# EAGLE design TIMER_ARDUINO(NPN) (EAGLE 6.1)
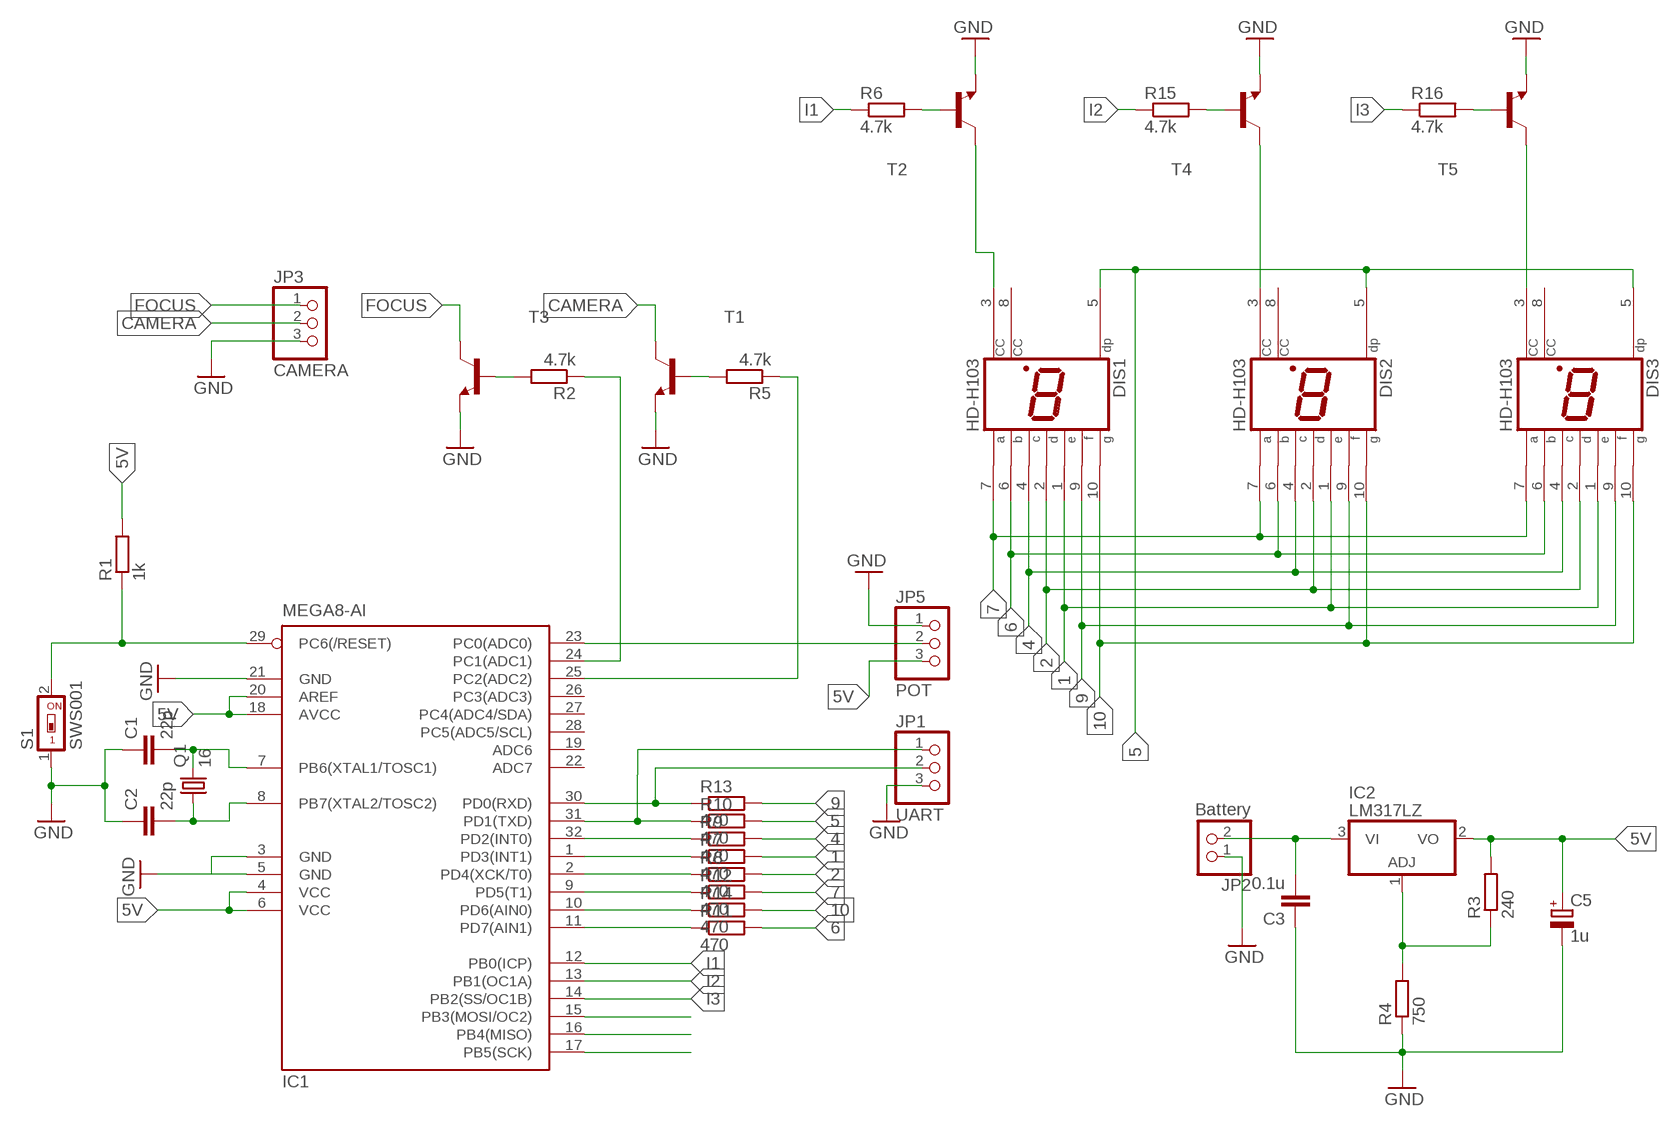
[diagram p0: schematic, sheet 1]

## Parts
C1  22p  C-EUC0805  [C0805]
C2  22p  C-EUC0805  [C0805]
C3  0.1u  C-EUC0805  [C0805]
C5  1u  CPOL-EU153CLV-0405  [153CLV-0405]
DIS1  HD-H103  [HDSP-M]
DIS2  HD-H103  [HDSP-M]
DIS3  HD-H103  [HDSP-M]
IC1  MEGA8-AI  [TQFP32-08]
IC2  LM317LZ  [TO92]
JP1  UART  PINHD-1X3  [1X03]
JP2  Battery  PINHD-1X2  [1X02]
JP3  CAMERA  PINHD-1X3  [1X03]
JP5  POT  PINHD-1X3  [1X03]
Q1  16  CRYSTALHC33U-V  [HC33U-V]
R1  1k  R-EU_R1206  [R1206]
R2  4.7k  R-EU_R0805  [R0805]
R3  240  R-EU_R0805  [R0805]
R4  750  R-EU_R0805  [R0805]
R5  4.7k  R-EU_R0805  [R0805]
R6  4.7k  R-EU_R0805  [R0805]
R7  470  R-EU_R0805  [R0805]
R8  470  R-EU_R0805  [R0805]
R9  470  R-EU_R0805  [R0805]
R10  470  R-EU_R0805  [R0805]
R11  470  R-EU_R0805  [R0805]
R12  470  R-EU_R0805  [R0805]
R13  470  R-EU_R0805  [R0805]
R14  470  R-EU_R0805  [R0805]
R15  4.7k  R-EU_R0805  [R0805]
R16  4.7k  R-EU_R0805  [R0805]
S1  SWS001  [SMS-001]
T1  BC846B-NPN-SOT23-BEC  [SOT23-BEC]
T2  BC846B-NPN-SOT23-BEC  [SOT23-BEC]
T3  BC846B-NPN-SOT23-BEC  [SOT23-BEC]
T4  BC846B-NPN-SOT23-BEC  [SOT23-BEC]
T5  BC846B-NPN-SOT23-BEC  [SOT23-BEC]

## Nets
1: DIS1.1(E) DIS2.1(E) DIS3.1(E) R7.2
2: DIS1.2(D) DIS2.2(D) DIS3.2(D) R8.2
4: DIS1.4(C) DIS2.4(C) DIS3.4(C) R9.2
5: DIS1.5(DP) DIS2.5(DP) DIS3.5(DP) R10.2
5V: C5.+ IC1.4(VCC) IC1.6(VCC) IC1.18(AVCC) IC1.20(AREF) IC2.2(VO) JP5.3 R1.2 R3.2
6: DIS1.6(B) DIS2.6(B) DIS3.6(B) R11.2
7: DIS1.7(A) DIS2.7(A) DIS3.7(A) R12.2
9: DIS1.9(F) DIS2.9(F) DIS3.9(F) R13.2
10: DIS1.10(G) DIS2.10(G) DIS3.10(G) R14.2
CAMERA: JP3.2 T1.C
FOCUS: JP3.1 T3.C
GND: C1.1 C2.1 C3.1 C5.- IC1.5(GND) IC1.21(GND) JP1.3 JP2.1 JP3.3 JP5.1 R4.1 S1.1 T1.E T2.E T3.E T4.E T5.E
I1: IC1.12(PB0(ICP)) R6.1
I2: IC1.13(PB1(OC1A)) R15.1
I3: IC1.14(PB2(SS/OC1B)) R16.1
N$1: IC1.29(PC6(/RESET)) R1.1 S1.2
N$2: IC1.23(PC0(ADC0)) JP5.2
N$3: IC1.3(GND)
N$4: IC1.30(PD0(RXD)) JP1.2 R13.1
N$5: IC1.31(PD1(TXD)) JP1.1 R10.1
N$6: C1.2 IC1.7(PB6(XTAL1/TOSC1)) Q1.2
N$7: IC1.32(PD2(INT0)) R9.1
N$8: C2.2 IC1.8(PB7(XTAL2/TOSC2)) Q1.1
N$9: IC1.1(PD3(INT1)) R7.1
N$10: IC1.2(PD4(XCK/T0)) R8.1
N$11: IC1.9(PD5(T1)) R12.1
N$12: IC1.10(PD6(AIN0)) R14.1
N$13: IC1.11(PD7(AIN1)) R11.1
N$14: R2.2 T3.B
N$15: C3.2 IC2.3(VI) JP2.2
N$16: IC2.1(ADJ) R3.1 R4.2
N$17: IC1.24(PC1(ADC1)) R2.1
N$18: IC1.15(PB3(MOSI/OC2))
N$19: IC1.16(PB4(MISO))
N$20: IC1.17(PB5(SCK))
N$21: R5.2 T1.B
N$22: IC1.25(PC2(ADC2)) R5.1
N$23: R6.2 T2.B
N$25: R15.2 T4.B
N$27: R16.2 T5.B
N$29: DIS1.3(CC) T2.C
N$30: DIS2.3(CC) T4.C
N$31: DIS3.3(CC) T5.C
Unconnected: DIS1.8(CC) DIS2.8(CC) DIS3.8(CC) IC1.19(ADC6) IC1.22(ADC7) IC1.26(PC3(ADC3)) IC1.27(PC4(ADC4/SDA)) IC1.28(PC5(ADC5/SCL))

## Library data of the parts
C1-C3 = resistor:C-EU: CAPACITOR, European symbol
C5 = resistor:CPOL-EU: POLARIZED CAPACITOR, European symbol
DIS1-DIS3 = display-hp:HD-H103: LED DISPLAY 1-character 7 segment, decimal point right; OC_FARNELL: unknown; OC_NEWARK: unknown
IC1 = atmel:MEGA8: MICROCONTROLLER 8 Kbytes FLASH, 1 kbytes SRAM, 512 bytes EEPROM, USART, 6-channel 10 bit ADC, 2-channel 8 bit ADC Pin compatible with Atmega48, ATMega88, ATMega168 Source: avr.lbr; MPN: ATMEGA8-16AU; OC_FARNELL: 9171371; OC_NEWARK: 73M8863
IC2 = linear:*317: Positive VOLTAGE REGULATOR
JP1 JP3 JP5 = pinhead:PINHD-1X3: PIN HEADER
JP2 = pinhead:PINHD-1X2: PIN HEADER
Q1 = crystal:CRYSTAL: CRYSTAL; OC_FARNELL: unknown; OC_NEWARK: unknown
R1-R16 = resistor:R-EU_: RESISTOR, European symbol
S1 = smd-special:SWS001: SMD Dip Switch 1 pol.
T1-T5 = transistor:*-NPN-: NPN Transistror BF959 corrected 2008.03.06

## Board
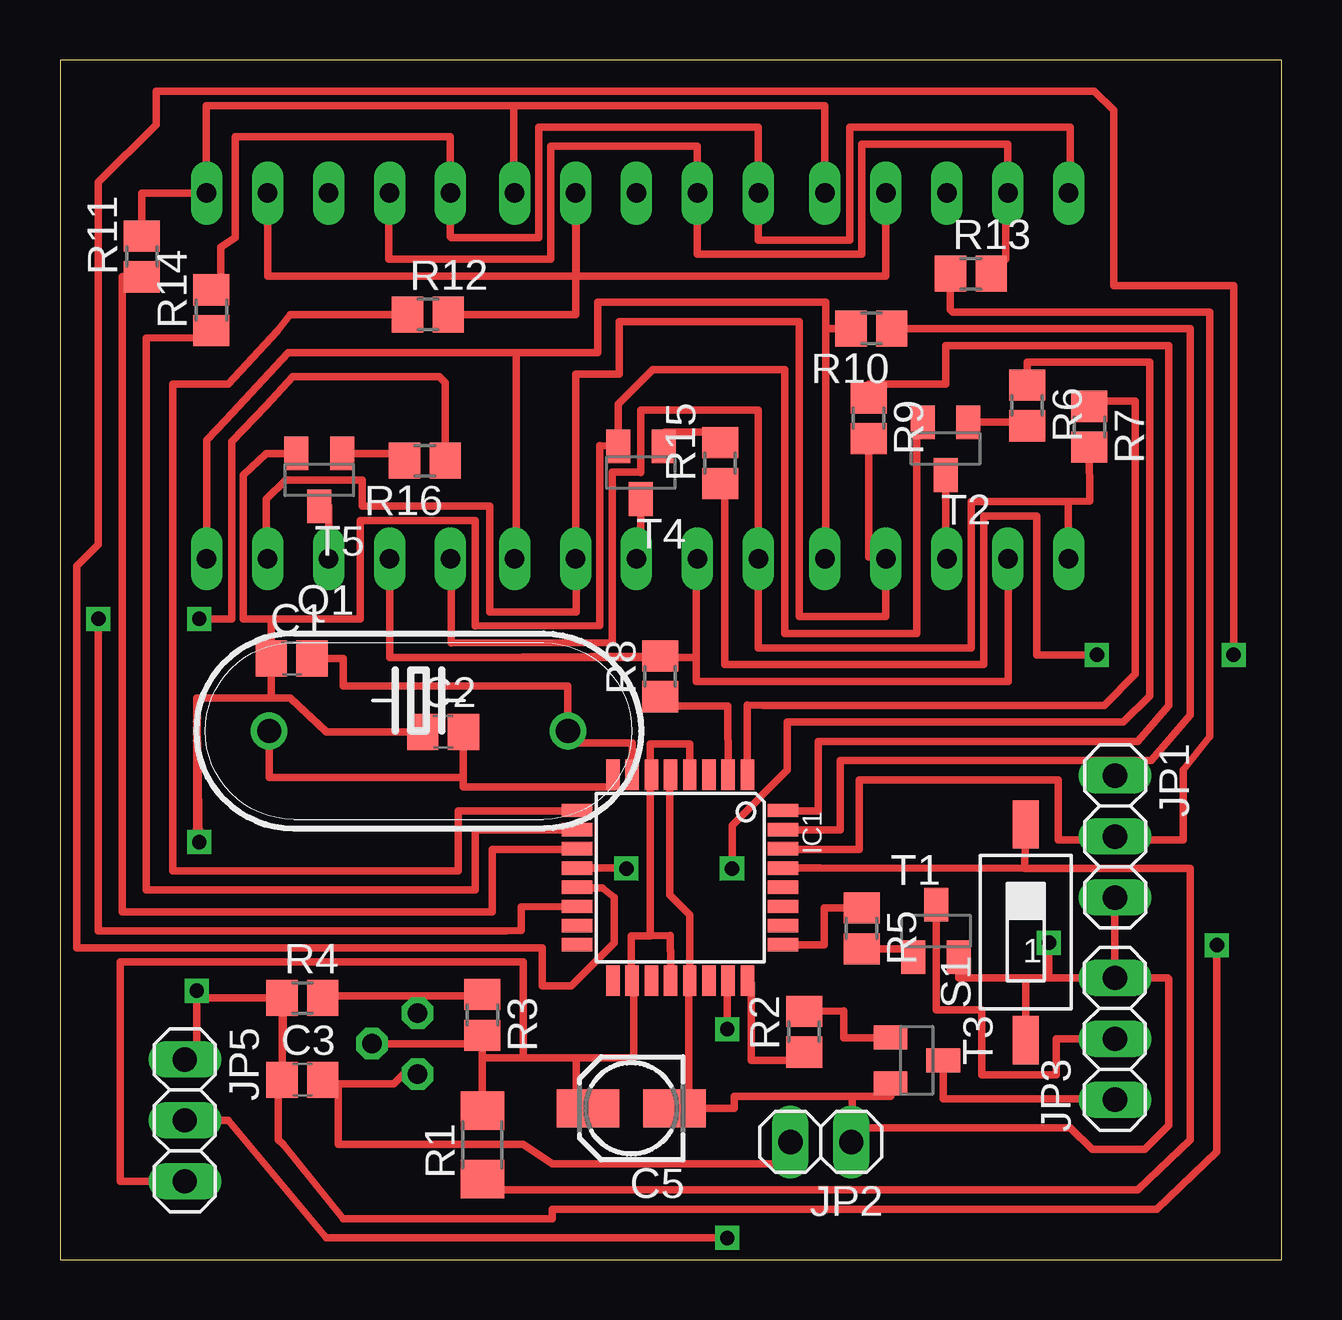
[diagram p1: board, top side]
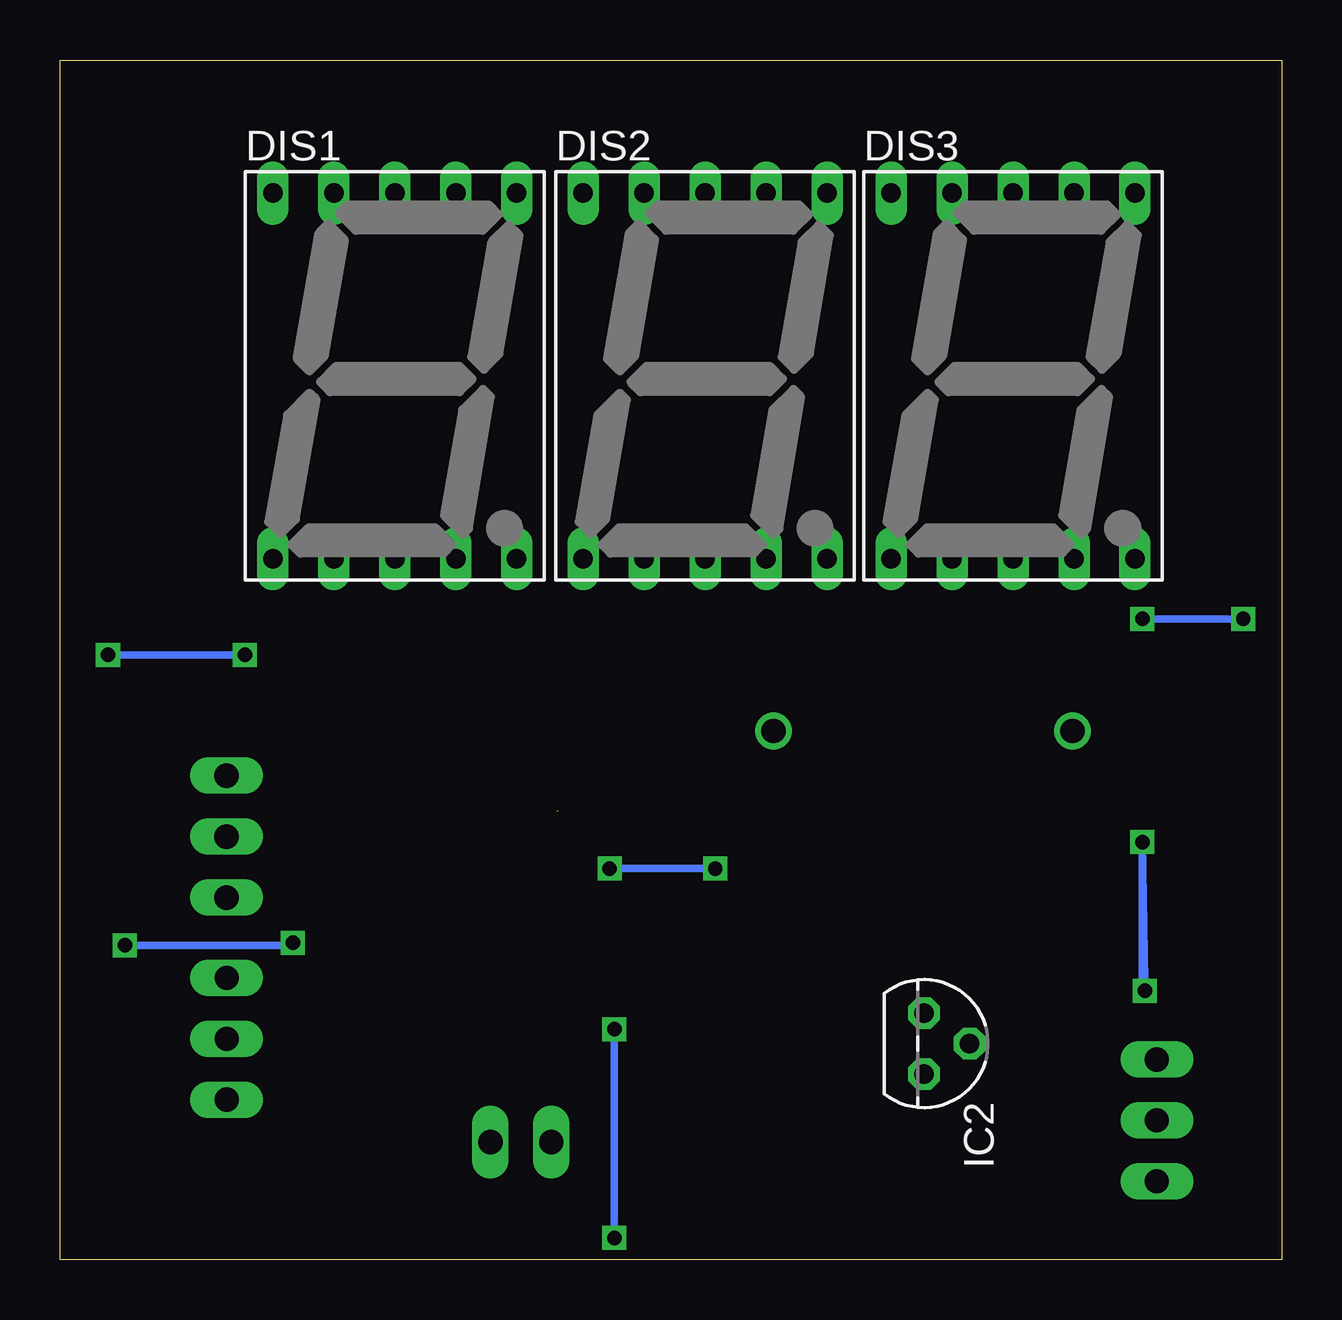
[diagram p2: board, bottom side, seen from below]

Size 50.9 x 50 mm. Coordinates in mm from the lower left corner, seen from the top.
Outline: 0,0 50.9,0 50.9,50 0,50 0,0
Copper layers (1*16): Top 0.035mm / dielectric 1.5mm / Bottom 0.035mm
Design rules: minimum track width 10mil, minimum drill 24mil, track to track 8mil, track to pad 8mil, pad to pad 8mil, via to via 8mil, smd to smd 8mil, copper to edge 40mil, drill to drill 8mil, minimum pad ring 10mil, minimum via ring 8mil, stop-mask expansion 4mil, vias tented up to drill 0mil, thermal gap 10mil

### Footprints (pad centres in the part's own frame; a part is rotated, then mirrored left to right if it is on the bottom)
C0805 = smd 1.3 x 1.5: 1 -0.85,0; 2 0.85,0
153CLV-0405 = smd 2.6 x 1.6: + 1.8,0; - -1.8,0
HDSP-M = drill 0.813 long: 1 -5.08,-7.62; 2 -2.54,-7.62; 3 0,-7.62; 4 2.54,-7.62; 5 5.08,-7.62; 6 5.08,7.62; 7 2.54,7.62; 8 0,7.62; 9 -2.54,7.62; 10 -5.08,7.62
TQFP32-08 = smd 1.27 x 0.559: 1 -4.293,2.8; 2 -4.293,2; 3 -4.293,1.2; 4 -4.293,0.4; 5 -4.293,-0.4; 6 -4.293,-1.2; 7 -4.293,-2; 8 -4.293,-2.8; 17 4.293,-2.8; 18 4.293,-2; 19 4.293,-1.2; 20 4.293,-0.4; 21 4.293,0.4; 22 4.293,1.2; 23 4.293,2; 24 4.293,2.8 | smd 0.559 x 1.27: 9 -2.8,-4.293; 10 -2,-4.293; 11 -1.2,-4.293; 12 -0.4,-4.293; 13 0.4,-4.293; 14 1.2,-4.293; 15 2,-4.293; 16 2.8,-4.293; 25 2.8,4.293; 26 2,4.293; 27 1.2,4.293; 28 0.4,4.293; 29 -0.4,4.293; 30 -1.2,4.293; 31 -2,4.293; 32 -2.8,4.293
TO92 = drill 0.813 octagon: 1 -1.27,0; 2 0,1.905; 3 1.27,0
1X03 = drill 1.016 long: 1 -2.54,0; 2 0,0; 3 2.54,0
1X02 = drill 1.016 long: 1 -1.27,0; 2 1.27,0
HC33U-V = drill 1.016: 1 -6.223,0; 2 6.223,0
R1206 = smd 1.6 x 1.803: 1 -1.422,0; 2 1.422,0
R0805 = smd 1.3 x 1.5: 1 -0.85,0; 2 0.85,0
SMS-001 = smd 1.092 x 2.007: 1 0,-4.496; 2 0,4.496
SOT23-BEC = smd 1 x 1.4: B -0.95,-1.1; C 0,1.1; E 0.95,-1.1

### Placement (x,y rotation side)
C1  9.65,25.05 0 top
C2  15.96,22 0 top
C3  10.1,7.5 0 top
C5  23.8,6.3 180 top
DIS1  36.95,36.83 0 bottom
DIS2  24.02,36.83 0 bottom
DIS3  11.19,36.83 0 bottom
IC1  25.84,15.92 270 top
IC2  14.9,9 270 bottom
JP1  43.96,17.63 270 top
JP2  31.7,4.9 180 top
JP3  43.95,9.2 90 top
JP5  5.2,5.8 270 top
Q1  14.94,22.03 0 top
R1  17.6,4.78 90 top
R2  31,9.5 90 top
R3  17.6,10.2 270 top
R4  10.1,10.9 0 top
R5  33.4,13.8 270 top
R6  40.3,35.6 270 top
R7  42.89,34.71 270 top
R8  25.01,24.31 90 top
R9  33.69,35.07 270 top
R10  33.81,38.81 180 top
R11  3.41,41.81 90 top
R12  15.33,39.39 0 top
R13  37.95,41.09 0 top
R14  6.31,39.57 90 top
R15  27.5,33.2 90 top
R16  15.2,33.3 180 top
S1  40.24,13.64 0 top
T1  36.5,13.7 0 top
T2  36.9,33.8 180 top
T3  35.7,8.3 270 top
T4  24.2,32.8 180 top
T5  10.8,32.5 180 top

### Tracks (layer width: path | path; a pad name or v marks a point on that pad's centre or on a via)
1
  Top 0.305: 16.3,29.21 16.3,25.7 23.02,25.72 23.02,32.82 24.2,32.82 | 42,31.6 37.96,31.6 37.96,25.5 29.1,25.5 DIS2.1 | 42,31.6 42,29.21 | 42,29 42,29.21 | 42,29.21 DIS1.1 | DIS2.1 29.1,32.8 | 42,31.6 42.9,31.61 R7.2 | DIS2.1 29.1,35.4 24.2,35.4 24.2,32.82 | 24.2,32.8 24.2,32.82
  Top 0.406: 16.3,29.21 DIS3.1
2
  Top 0.305: DIS3.2 13.73,25.1 16.34,25.1 | 16.34,25.1 26.5,25.1 | 26.5,25.1 26.5,29.21 DIS2.2 | 26.5,25.1 26.5,24.1 39.5,24.1 DIS1.2 | R8.2 16.34,25.1
  Top 0.406: 13.7,29.21 DIS3.2 | DIS1.2
4
  Top 0.305: 21.5,29.21 21.5,27 17.9,27 17.9,31.4 12.6,31.4 12.6,32.5 9.4,32.5 8.6,31.7 8.6,29.26 DIS3.4 | DIS2.4 21.48,36.9 23.3,36.9 23.3,39.1 30.8,39.1 30.8,26.8 34.4,26.8 DIS1.4 | R9.2 33.7,31.6 33.7,29.29 34.49,29.29 DIS1.4
  Top 0.406: 21.5,29.21 DIS2.4 | DIS1.4
5
  Top 0.305: DIS3.5 6.11,33.6 6.11,34.16 6.9,35 9.5,37.8 19,37.8 | 19,37.8 19,29.2 DIS2.5 | 19,37.8 22.4,37.8 22.4,39.9 31.9,39.9 31.9,36.8 | 31.9,36.8 31.9,29.21 DIS1.5 | R10.2 31.91,38.8 31.9,36.8
5V
  Top 0.305: IC1.4 26.24,21.5 24.6,21.5 24.6,20.21 IC1.6 24.6,20.17 24.6,13.5 | IC1.20 25.44,12.86 25.44,12.89 25.43,13.51 24.6,13.5 | 24.6,13.5 23.8,13.5 23.8,11.67 IC1.18 23.9,11.63 23.9,8.4 21.5,8.4 | 17.6,8.4 R1.2 | 17.6,8.4 R3.2 17.45,9 IC2.2 17.9,9 | 17.6,8.4 19.3,8.4 | 19.3,8.4 21.5,8.4 | C5.+ 21.5,6.8 21.5,8.4 | 19.3,8.4 19.3,12.4 2.5,12.4 2.5,3.26 JP5.3
6
  Top 0.305: DIS1.6 31.87,48.1 18.9,48.1 | DIS2.6 18.9,44.45 18.9,48.1 | 18.9,48.1 6.1,48.1 DIS3.6 | DIS3.6 6.11,44.5 | DIS3.6 3.4,44.45 3.4,42.6 3.41,42.6 R11.2
  Top 0.406: 19,44.45 DIS2.6
7
  Top 0.305: DIS1.7 34.4,41 21.5,41 21.5,44.45 DIS2.7 21.48,41 | 21.48,41 8.65,41 DIS3.7 | R12.2 21.48,39.39 21.48,41
  Top 0.406: DIS1.7
9
  Top 0.305: DIS3.9 13.7,44.45 13.7,41.7 20.46,41.7 20.46,46.4 26.56,46.4 DIS2.9 26.56,41.9 33.4,41.9 33.4,46.5 39.49,46.5 DIS1.9 39.4,44.45 39.4,41.69 R13.2
10
  Top 0.305: 42.1,44.45 42.1,47.2 32.9,47.2 32.9,42.5 29.1,42.5 DIS2.10 29.1,47.2 19.96,47.2 19.96,42.6 16.3,42.6 16.27,42.63 DIS3.10 16.27,46.8 7.3,46.8 7.3,42.6 6.7,42.2 6.7,41.8 6.71,40.4 R14.2
  Top 0.406: 42.1,44.45 DIS1.10
CAMERA
  Top 0.305: JP3.2 41.5,9.2 41.5,7.7 38.4,7.7 38.4,10.4 36.5,10.4 T1.C
FOCUS
  Top 0.305: JP3.1 42.7,6.66 42.7,6.7 36.8,6.7 T3.C
GND  (via drill 0.6)
  Top 0.305: C3.1 R4.1 9.2,10.9 | C3.1 9.15,6.85 | 9.15,6.85 9.1,6.8 9.1,5 9.3,4.8 11.8,1.7 20.5,1.7 20.5,2.1 45.7,2.1 48.2,4.5 v48.2,13.1 | 5.8,10.9 5.7,10.9 v5.7,11.2 5.7,8.34 JP5.1 | 9.1,6.9 C3.1 | 11.11,22 9.6,23.4 | 8.8,23.4 5.7,23.4 | 5.7,23.4 v5.8,17.4 5.7,17.5 5.7,23.4 | 8.8,23.4 C1.1 8.8,26.7 | JP3.3 43.9,11.8 | S1.1 40.24,11.73 40.2,11.74 | 40.2,11.74 41.2,11.74 | 41.2,11.74 JP3.3 | JP1.3 JP3.3 | C5.- 26.2,6.3 | 26.2,6.3 28.1,6.3 28.1,6.8 33,6.8 | JP3.3 46.16,11.74 46.2,11.7 46.2,5.6 45.2,4.6 43,4.6 42.1,5.5 33.2,5.5 32.97,5.73 | 26.2,6.3 26.2,11.59 IC1.21 26.24,14.36 25.4,15.2 25.4,20.17 IC1.5 | 32.97,5.73 JP2.1 | 32.97,5.73 33,5.76 33,6.8 | C2.1 11.11,22 | 11.11,22 11.1,22 9.6,23.4 | 9.6,23.4 8.8,23.4 | 5.7,11 5.8,10.9 | 5.8,10.9 9.2,10.9 | 9.2,10.9 9.3,11 9.3,9.3 | 9.2,6.9 9.15,6.85 | v41.2,13.2 41.2,11.74 | T3.E 34.61,6.81 33,6.8 | T1.E 37.45,11.74 40.2,11.74 | T5.E 8.6,33.6 7.65,32.7 7.65,26.7 8.8,26.7 | 8.8,26.7 12.5,26.7 12.5,30.8 17.3,30.8 17.3,26.4 22.49,26.42 22.49,33.92 T4.E 23.25,35.65 24.7,37.1 30.2,37.1 30.2,26.1 35.7,26.1 35.7,34.65 T2.E
  Bottom 0.305: v48.2,13.1 41.3,13.1 v41.2,13.2 | v5.7,11.2 5.7,11.6 v5.8,17.4 5.8,11.3 v5.7,11.2
I1  (via drill 0.6)
  Top 0.305: IC1.12 23.68,16.32 v23.6,16.3 | v28,16.3 28,18.1 30.3,20.4 30.3,22.4 44.3,22.4 45.4,23.5 45.4,37.4 40.3,37.4 R6.1
  Bottom 0.305: v23.6,16.3 v28,16.3
I2  (via drill 0.6)
  Top 0.305: R15.1 arc-90 27.7,32.15 27.7,24.8 38.48,24.8 38.48,31 40.7,31 40.7,25.2 v43.2,25.2 | v48.9,25.2 48.9,40.6 43.9,40.6 43.9,47.9 43.1,48.7 4,48.7 4,47.3 1.6,44.9 1.6,29.8 0.7,28.9 0.7,13 20.1,13 20.1,11.4 21.3,11.4 23.1,13.2 23.1,15.1 22.6,15.5 21.57,15.5 IC1.13
  Bottom 0.305: v43.2,25.2 v48.9,25.2
I3  (via drill 0.6)
  Top 0.305: v1.6,26.7 1.6,13.7 18.6,13.7 19.21,13.71 19.23,14.7 IC1.14 | R16.1 16.05,36.55 15.8,36.8 9.7,36.8 8.6,35.6 7.15,34.09 7.15,26.69 v5.8,26.7
  Bottom 0.305: v5.8,26.7 v1.6,26.7
N$1
  Top 0.305: IC1.29 31.68,16.32 40.2,16.3 | 40.2,16.3 47.1,16.3 47.1,5 44.9,2.9 17.6,2.9 R1.1 | S1.2 40.2,16.3
N$2  (via drill 0.6)
  Top 0.305: v27.8,0.9 11.1,0.9 7,5.8 JP5.2 | v27.8,9.6 27.8,11.59 IC1.23
  Bottom 0.305: v27.8,0.9 v27.8,9.6
N$4
  Top 0.305: R13.1 37.1,39.6 37.2,39.5 47.9,39.5 47.9,21.8 46.8,20.4 46.8,17.5 44.26,17.5 | 44.26,17.5 41.6,17.5 41.6,20 33.3,20 33.3,17.1 30.15,17.1 IC1.30 | 44.26,17.5 JP1.2
N$5
  Top 0.305: R10.1 36.54,38.8 47.1,38.8 47.1,22.7 45.46,20.8 44,20.8 | 44,20.8 32.5,20.8 32.5,17.9 30.13,17.9 | IC1.31 30.13,17.9 | 30.13,17.9 30.1,17.9 | 44,20.8 44,20.27 JP1.1
N$6
  Top 0.305: C1.2 11.8,25.05 11.8,23.9 21.16,23.9 21.16,22.4 Q1.2 | IC1.7 23.84,21.53 21.16,21.53 Q1.2 | Q1.2
N$7  (1 unrouted)
  Top 0.305: R9.1 33.7,36.4 33.7,36.5 36.9,36.5 36.9,38.1 46.2,38.1 46.2,23.1 44.9,21.6 31.6,21.6 31.6,18.7 30.2,18.7
N$8
  Top 0.305: C2.2 16.8,19.7 | 16.8,19.7 23.1,19.7 23.1,20.2 23.05,20.2 IC1.8 | Q1.1 8.72,20.1 16.8,20.1 16.8,19.7
N$9
  Top 0.305: R7.1 42.99,35.79 44.8,35.79 44.8,24.4 43.5,23.1 29.3,23.1 28.64,23.11 IC1.1
N$10
  Top 0.305: R8.1 25,23.3 25,23.07 27.83,23.07 IC1.2
N$11
  Top 0.305: R12.1 9.6,39.39 9.05,38.7 7,36.5 4.7,36.5 4.7,16.2 16.6,16.2 16.6,18.7 21.55,18.7 IC1.9
N$12
  Top 0.305: R14.1 6,38.42 3.6,38.4 3.6,15.4 17.3,15.4 17.3,17.9 21.55,17.9 IC1.10
N$13
  Top 0.305: R11.1 2.6,40.96 2.6,14.5 18,14.5 18,17.1 21.55,17.1 | 21.55,17.1 21.6,17.1 | IC1.11 21.55,17.1
N$14
  Top 0.305: R2.2 32.66,10.37 32.66,9.25 T3.B
N$15
  Top 0.305: 11.02,7.63 C3.2 11.23,7.5 11.41,7.32 | JP2.2 30.4,4.6 30.4,4 20.5,4 19.3,4.8 11.6,4.8 11.6,7.13 11.41,7.32 | IC2.3 14.33,7.73 13.91,7.32 11.41,7.32
N$16
  Top 0.305: R4.2 11.05,11 14.9,11 | 14.9,11 IC2.1 | R3.1 17.55,11 14.9,11
N$17
  Top 0.305: IC1.24 28.8,11.53 28.8,8.3 31,8.3 R2.1
N$21
  Top 0.305: R5.2 35.58,12.95 T1.B
N$22
  Top 0.305: IC1.25 31.85,13.12 31.85,14.66 R5.1
N$23
  Top 0.305: R6.2 40.3,34.9 T2.B
N$25
  Top 0.305: R15.2 27.15,34.5 25.2,34.5 25.2,33.9 T4.B
N$27
  Top 0.305: T5.B 14.15,33.6 R16.2
N$29
  Top 0.305: T2.C 36.9,29.2 37,29.2 37,29.21 DIS1.3
N$30
  Top 0.305: T4.C 24.2,29.21 DIS2.3
N$31
  Top 0.305: T5.C 11.2,31.4 DIS3.3